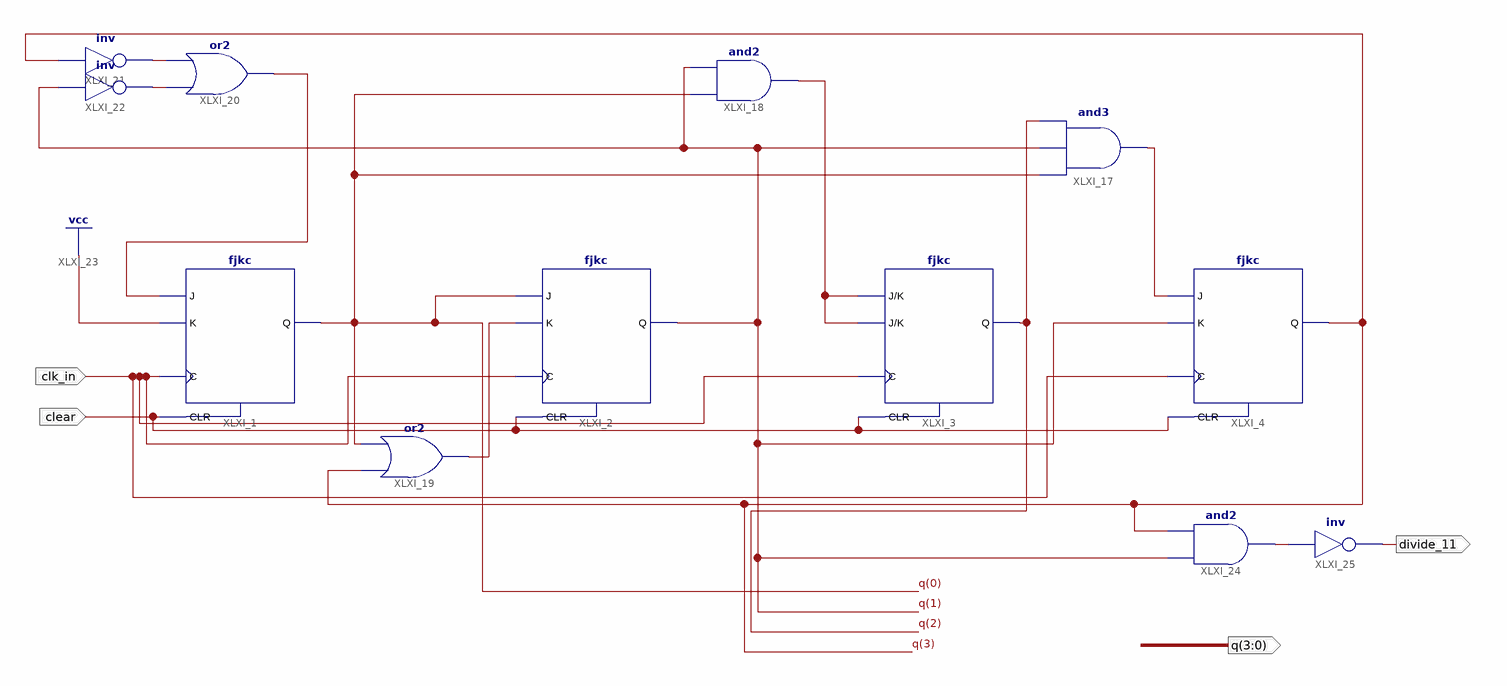
[diagram p0: schematic sheet 1]
// Xilinx ISE schematic counter010.sch (spartan6) as structural Verilog: 12 symbols, 4 ports
module counter010 (
  input  clk_in,
  input  clear,
  output [3:0] q,
  output divide_11
);

  wire XLXN_4, XLXN_7, XLXN_11, XLXN_12, XLXN_13, XLXN_16, XLXN_26;

  fjkc XLXI_1 (.C(clk_in), .CLR(clear), .J(XLXN_16), .K(1'b1), .Q(q[0]));
  fjkc XLXI_2 (.C(clk_in), .CLR(clear), .J(q[0]), .K(XLXN_11), .Q(q[1]));
  fjkc XLXI_3 (.C(clk_in), .CLR(clear), .J(XLXN_7), .K(XLXN_7), .Q(q[2]));
  fjkc XLXI_4 (.C(clk_in), .CLR(clear), .J(XLXN_4), .K(q[1]), .Q(q[3]));
  and XLXI_17 (XLXN_4, q[0], q[1], q[2]);
  and XLXI_18 (XLXN_7, q[0], q[1]);
  or XLXI_19 (XLXN_11, q[3], q[0]);
  or XLXI_20 (XLXN_16, XLXN_13, XLXN_12);
  not XLXI_21 (XLXN_12, q[3]);
  not XLXI_22 (XLXN_13, q[1]);
  and XLXI_24 (XLXN_26, q[1], q[3]);
  not XLXI_25 (divide_11, XLXN_26);
endmodule
